# Altium schematic sheet POWER.SchDoc
size Letter; SheetNumber: 1; SheetTotal: 4
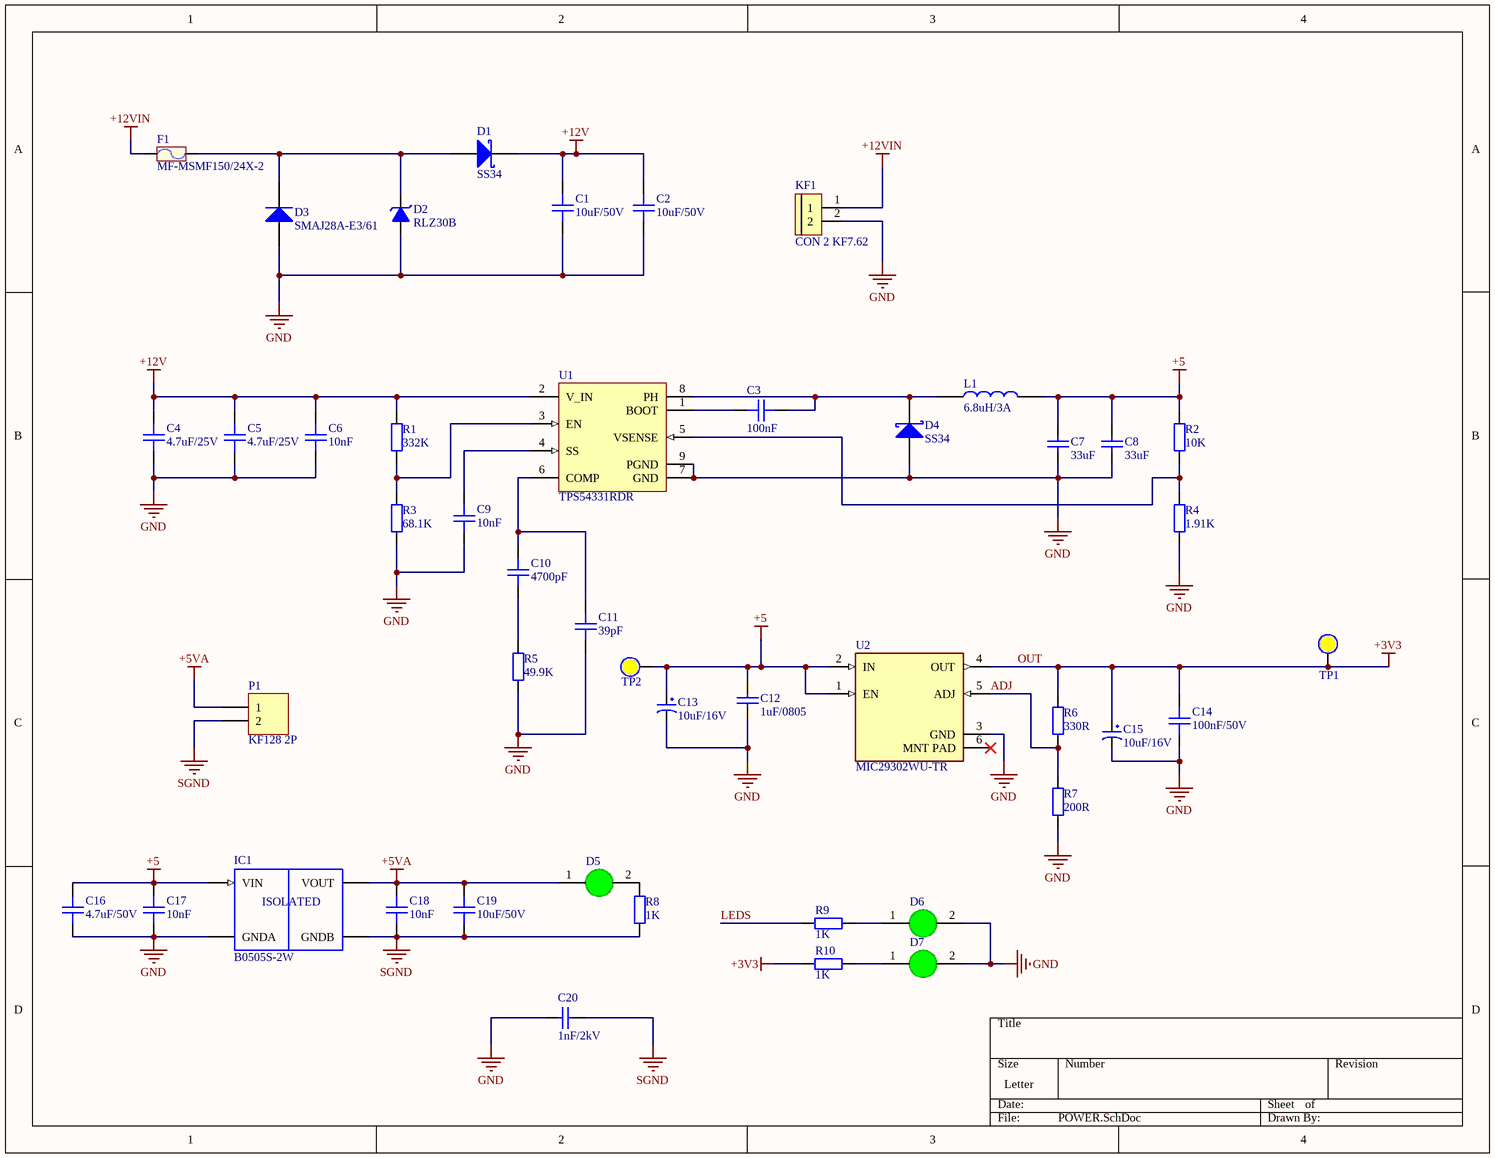
[diagram p0: POWER.SchDoc]

## Parts
C1  10uF/50V  [1210]
C2  10uF/50V  [1210]
C3  100nF  [CAPC-0603 (1608)]
C4  4.7uF/25V  [CAPC-1210 (3225)]
C5  4.7uF/25V  [CAPC-1210 (3225)]
C6  10nF  [CAPC-0603 (1608)]
C7  33uF  [tu 1206]
C8  33uF  [tu 1206]
C9  10nF  [CAPC-0603 (1608)]
C10  4700pF  [CAPC-0603 (1608)]
C11  39pF  [CAPC-0603 (1608)]
C12  1uF/0805  [tu 0805]
C13  10uF/16V  [2312]
C14  100nF/50V  [C0805]
C15  10uF/16V  [2312]
C16  4.7uF/50V  [CAPC-0805 (2012)]
C17  10nF  [CAPC-0603 (1608)]
C18  10nF  [CAPC-0603 (1608)]
C19  10uF/50V  [CAPC-0805 (2012)]
C20  1nF/2kV  [tu 1206]
D1  SS34  [DIODE_DO214AC_SMA]
D2  RLZ30B  [SOD_80]
D3  SMAJ28A-E3/61  [VISH-DO-214AC-2_L]
D4  SS34  [DIODE_DO214AC_SMA]
D5  (no value)  [LED_0805_GREEN]
D6  (no value)  [LED_0805_GREEN]
D7  (no value)  [LED_0805_GREEN]
F1  MF-MSMF150/24X-2  [1812]
IC1  B0505S-2W  [B0505S-2W]
KF1  CON 2 KF7.62  [CON 2 KF7.62]
L1  6.8uH/3A  [Cuon Cam 12x12x10]
P1  KF128 2P  [KF128_2P]
R1  332K  [RESC-0603 (1608)]
R2  10K  [RESC-0805 (2012)]
R3  68.1K  [RESC-0603 (1608)]
R4  1.91K  [RESC-0805 (2012)]
R5  49.9K  [RESC-0603 (1608)]
R6  330R  [RESC-0805 (2012)]
R7  200R  [RESC-0805 (2012)]
R8  1K  [RESC-0805 (2012)]
R9  1K  [RESC-0805 (2012)]
R10  1K  [RESC-0805 (2012)]
TP1  (no value)  [Test Point 1 MM]  (no BOM)
TP2  (no value)  [Test Point 1 MM]  (no BOM)
U1  TPS54331RDR  [SOIC-8-TP]
U2  MIC29302WU-TR  [FP-C04-012-MFG]

## Nets
+5: C7.1 C8.1 C12.1 C13.1 C16.2 C17.2 IC1.VIN L1.2 R2.2 TP2.0 U2.1(EN) U2.2(IN)
+5VA: C18.2 C19.2 D5.1(A) IC1.VOUT P1.1
+12V: C1.2 C2.2 C4.2 C5.2 C6.2 D1.2(K) R1.2 U1.2(V_IN)
+12VIN: F1.1 KF1.1
GND: C1.1 C2.1 C4.1 C5.1 C6.1 C7.2 C8.2 C9.1 C11.1 C12.2 C13.2 C14.1 C15.2 C16.1 C17.1 C20.2 D2.1(A) D3.2(A) D4.1(A) D6.2(K) D7.2(K) IC1.GNDA KF1.2 R3.1 R4.1 R5.1 R7.1 U1.7(GND) U1.9(PGND) U2.3(GND)
OUT: C14.2 C15.1 R6.2 R10.1 TP1.0 U2.4(OUT)  [also labelled +3V3]
SGND: C18.1 C19.1 C20.1 IC1.GNDB P1.2 R8.2
ADJ: R6.1 R7.2 U2.5(ADJ)
LEDS: R9.1
NetC3_1: C3.1 U1.1(BOOT)
NetC3_2: C3.2 D4.2(K) L1.1 U1.8(PH)
NetC9_2: C9.2 U1.4(SS)
NetC10_1: C10.1 R5.2
NetC10_2: C10.2 C11.2 U1.6(COMP)
NetD1_1: D1.1(A) D2.2(K) D3.1(K) F1.2
NetD5_2: D5.2(K) R8.1
NetD6_1: D6.1(A) R9.2
NetD7_1: D7.1(A) R10.2
NetR1_1: R1.1 R3.2 U1.3(EN)
NetR2_1: R2.1 R4.2 U1.5(VSENSE)

Not connected (* = marked no-connect by the designer): U2 6(MNT_PAD)*

## Notes on the sheet
- (in symbol B0505S-2W) ISOLATED

## Library data of the parts
C1 C2 = CAP_CER_1210_10uF: CAP CER 10uF/50V 1210; Manufacturer: Yageo; Part number: C1210; Cost: 3400; ComponentLink1Description: Link product; ComponentLink1URL: https://www.thegioiic.com/tu-gom-1210-10uf-50v; Package: 1210
C3 = CC0603ZRY5V9BB224: CAP CER 0.22UF 50V Y5V 0603; Value: 224/50V; Solder: SMT; MPN: CC0603ZRY5V9BB224; Category: CAPACITOR; PinCount: 2
C4 C5 = CC1210KKX7R9BB105: CAP CER 1UF 50V X7R 1210; MFR: Yageo; Value: 105/50V; Solder: SMT; MPN: CC1210KKX7R9BB105; Category: CAPACITOR; PinCount: 2
C6 C9 C17 C18 = CC0603KRX7R7BB103: CAP CER 10nF 16V 10% X7R 0603; CompanyID: VT-00592; Solder: SMT; Value: 103/16V; MPN: CC0603KRX7R7BB103; Category: CAPACITOR; PinCount: 2
C7 C8 = Tu 1206 100pF 50V 5%: Dán; Don_Vi: Con; So_Chan: 2; Ten_Linh_Kien: Tụ 1206 100P 5% 50V; Ma_Hang: MH008101; Chung_Loai: Dán; Kieu_Chan: *
C10 = CC0603KRX7R9BB822: CAP CER 8200PF 50V X7R 0603; MFR: Yageo; Value: 822/50V; Solder: SMT; MPN: CC0603KRX7R9BB822; Category: CAPACITOR; PinCount: 2
C11 = CC0603JRNPO9BN560: CAP CER 56PF 50V 5% COG/NPO 0603; Solder: SMT; CompanyID: VT-00150; Value: 56pF/50V; MPN: CC0603JRNPO9BN560; Category: CAPACITOR; PinCount: 2
C12 = Tu 0805 104 50V 10%: Dán; Don_Vi: Con; So_Chan: 2; Ten_Linh_Kien: Tụ 0805 104-100nF 10% 50V; Ma_Hang: MH004551; Chung_Loai: Dán; Kieu_Chan: *; ComponentLink1Description: New link; ComponentLink1URL: https://www.thegioiic.com/tu-gom-0805-1uf-25v
C13 C15 = CAP_TANT_2312_100uF: CAP TANT 100uF/10V 2312; Manufacturer: AVX; Part number: TAJC107K010RNJ; Cost: 5000; ComponentLink1Description: Link product; ComponentLink1URL: https://www.thegioiic.com/tu-tantalum-100uf-10v-2312-tajc107k010rnj; Package: 2312
C14 = CAP_CER_0805_100nF: CAP CER 100nF/50V 0805; Manufacturer: Samsung; Cost: 190; Part number: C0805; ComponentLink1Description: Link product; ComponentLink1URL: https://www.thegioiic.com/tu-gom-0805-100nf-0-1uf-50v; Package: 0805
C16 = CC0805ZRY5V6BB475: CAP CER 4.7uF -20% +80% 10V Y5V 0805; Value: 475/10V; Solder: SMT; CompanyID: VT-01178; MPN: CC0805ZRY5V6BB475; Category: CAPACITOR; PinCount: 2
C19 = CC0805MKX5R6BB226: CAP CER 22uF 20% 10V X5R 0805; Solder: SMT; Value: 226/10V; CompanyID: VT-01177; MPN: CC0805MKX5R6BB226; Category: CAPACITOR; PinCount: 2
C20 = Tu 1206 470pF 50V 10%: Dán; Don_Vi: Con; So_Chan: 2; Ten_Linh_Kien: Tụ 1206 470P 10% 50V; Ma_Hang: MH004548; Chung_Loai: Dán; Kieu_Chan: *
D1 D4 = SS34: DIODE SCHOTTKY 40V 3A SMA; Solder: SMT; MPN: SS34; Value: SS34; MFR: *
D2 = DIO_ZMM15: ZMM15 15V 500mW SMD SOD-80; Manufacturer: On Semiconductor; Cost: 250; Part number: ZMM15; Package: SOD-80 2L; ComponentLink1Description: Link product; ComponentLink1URL: https://www.thegioiic.com/rlz30b-diode-zener-27-70-29-13v-500mw-smd
D3 = VISH-K1A2-2: Transient Voltage Suppressor, 6.40 to 231 V, 28 V Stand-off Voltage, Uni-Directional, -55 to 155 degC, 2-pin DO-214AC, Pb-Free, Tape and Reel; Manufacturer: Vishay Semiconductor; IFSM: 40 A; VBR Uni-Directional (V): 6.4 to 231; ID (uA): 1; VWM (V): 28; PPPM (W): 400, 300; PackageReference: DO-214AC-2; Packing: Tape and Reel; RoHS: TRUE; PartNumber: SMAJ28A-E3/61; PackageDescription: 2-Pin DO-214AC (SMA), Body 4.245 x 2.665 mm; Mounting Technology: Surface Mount; DatasheetVersion: 12/8/2013; Operating Junction and Storage Temperature Range: -55 to 150 degC; ComponentLink4Description: New link; ComponentLink4URL: https://www.thegioiic.com/smaj28a-e3-61-tvs-diode-28v-45-4v-do214ac
D5-D7 = 17-21/G6C-FM1N2B/3T: LED GREEN CLEAR 2V4 20mA 0805 SMD; Value: 2V4/20mA; CompanyID: VT-00393; Solder: SMT; MPN: 17-21/G6C-FM1N2B/3T
F1 = FUSE_16V_2.5A: MF-MSMF250/16 16V 2.5A1812; Manufacturer: Bourns; Cost: 3000; Part number: 1812; ComponentLink1Description: Link product; ComponentLink1URL: https://www.thegioiic.com/mf-msmf150-24x-2-cau-chi-tu-phuc-hoi-1812-24v-1-5a; Package: 1812
IC1 = B0505S-2W: <h1>B0505S-2W </h1> <br> Is a 5V-5V isolated DC-DC converter <br> Specs: <br>2W (400mA) <H3> note: max 220ÂµF Capacity on rail!</h3> Datasheet: <a href="https://www.mornsun-power.com/uploads/pdf/B_S-2W.pdf">B0505S-2W</a>; Package: None; MF: MORNSUN; Value: *; SnapEDA_Link: https://www.snapeda.com/parts/B0505S-2W/MORNSUN/view-part/586697/?ref=snap; Price: None; MP: B0505S-2W; Availability: Unavailable
KF1 = CON 2 KF7.62: Cắm; Ma_Hang: MH002053; Ten_Linh_Kien: CON 2 KF7.62-2P 7.62MM (Đen Thẳng); Chung_Loai: Cắm; Ghi_Chu: *; Kieu_Chan: *; Don_Vi: Con
L1 = CUON CAM 100uH SMD: Dán; Don_Vi: Con; Ma_Hang: MH003999; Ten_Linh_Kien: Cuộn Cảm 100uH 7x7x4MM CD74; Ma_Hang: *; Kieu_Chan: *; Chung_Loai: Dán
P1 = KF128 2P: Header, 2-Pin, pitch 5.08mm; MPN: KF128-2P; Solder: WAVE
R1 = RC0603FR-07330KL: RES SMD 330K OHM 1% 1/10W 0603; Solder: SMT; CompanyID: VT-01025; MPN: RC0603FR-07330KL; Value: 330K; Category: RESISTOR
R2 = RC0805FR-0710KL: RES SMD 10K OHM 1% 1/8W 0805; CompanyID: VT-00007; Solder: SMT; Value: 10K; MPN: RC0805FR-0710KL; Category: RESISTOR
R3 = RC0603FR-0768KL: RES SMD 68K OHM 1% 1/10W 0603; Solder: SMT; MPN: RC0603FR-0768KL; Value: 68K; Category: RESISTOR
R4 = RC0805FR-071K1L: RES SMD 1.1K OHM 1% 1/8W 0805; Solder: SMT; CompanyID: VT-00993; Value: 1K1; MPN: RC0805FR-071K1L; Category: RESISTOR
R5 = RC0603FR0747KL: RES SMD 47K OHM 1% 1/10W 0603; CompanyID: VT-00322; Solder: SMT; Value: 47K; MPN: RC0603FR0747KL; Category: RESISTOR
R6 = RC0805FR-07330RL: RES SMD 330 OHM 1% 1/8W 0805; CompanyID: VT-00009; Solder: SMT; Value: 330R; MPN: RC0805FR-07330RL; Category: RESISTOR
R7 = RC0805FR-07300RL: RES SMD 300 OHM 1% 1/8W 0805; Solder: SMT; Value: 300R; CompanyID: VT-00929; MPN: RC0805FR-07300RL; Category: RESISTOR
R8-R10 = RC0805FR-071KL: RES SMD 1K OHM 1% 1/8W 0805; Solder: SMT; CompanyID: VT-00024; Value: 1K; MPN: RC0805FR-071KL; Category: RESISTOR
TP1 TP2 = Test Point: Solder: NF
U1 = TPS54360DDAR: Step Down DC-DC Converter; Solder: SMT; MPN: TPS54360DDAR; Value: TPS54360; Category: IC
U2 = CMP-06324-000007-1: IC REG LINEAR POS ADJ 3A TO263-5; Manufacturer: Microchip; Output Voltage: 3.3-12V; Output Type: AdjustableProgrammable; Max Junction Temp: +125°C; Standoff Height: 0mm; Accuracy Percentage: 1%; Max Supply Voltage: 26V; Nominal Supply Current: 10-37mA; Number Of Outputs: 1; Dropout Voltage: 370mV; Min Supply Voltage: 2.25V; Device Class L1: Integrated Circuits (ICs); Digikey Description: IC REG LINEAR POS ADJ 3A TO263-5; Device Class L2: Power Management ICs; Lead Free: Yes; Mouser Description: LDO Voltage Regulators; Package: C04-012; Temperature: -40°C to +125°C; Temperature Range High: +125°C; Automotive: No; Device Class L3: Voltage Regulators - Linear; Category: IC; Temperature Range Low: -40°C; RoHS: TRUE; Output Current: 3A; Octopart: https://octopart.com/mic29302wu-tr-microchip-66801318; Manufacturer Part Number: MIC29302WU-TR; Height: 0.2inch; ComponentLink3Description: New link; ComponentLink3URL: https://www.thegioiic.com/mic29302-ic-dieu-chinh-dien-ap-3a